# Altium schematic sheet Schematic Tugas 1_Magang 2.SchDoc
size A4; SheetNumber: 1; SheetTotal: 1
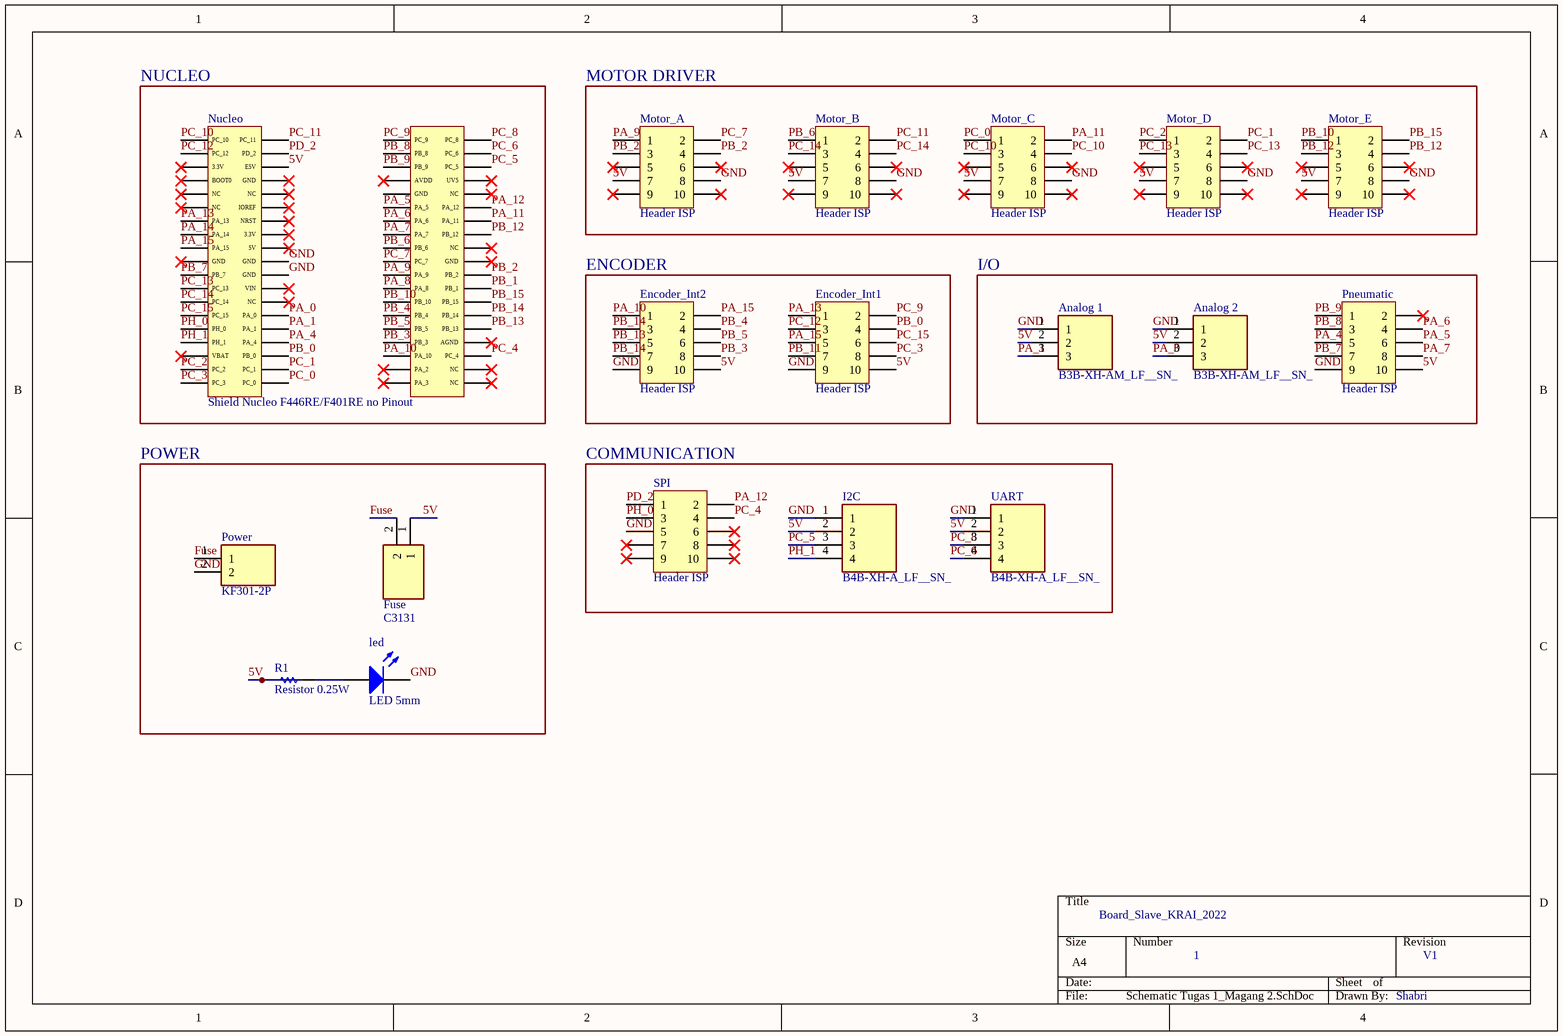
[diagram p0: Schematic Tugas 1_Magang 2.SchDoc]

## Parts
Analog_1  B3B-XH-AM_LF__SN_  [B3BXHAMLFSN]
Analog_2  B3B-XH-AM_LF__SN_  [B3BXHAMLFSN]
Encoder_Int1  Header ISP  [Header ISP]
Encoder_Int2  Header ISP  [Header ISP]
Fuse  C3131  [C3131]
I2C  B4B-XH-A_LF__SN_  [B4BXHALFSN]
led  LED 5mm  [LED 5mm]
Motor_A  Header ISP  [Header ISP]
Motor_B  Header ISP  [Header ISP]
Motor_C  Header ISP  [Header ISP]
Motor_D  Header ISP  [Header ISP]
Motor_E  Header ISP  [Header ISP]
Nucleo  Shield Nucleo F446RE/F401RE no Pinout  [Shield Nucleo-F446RE/F401RE-tanpaPinOut]
Pneumatic  Header ISP  [Header ISP]
Power  KF301-2P  [KF3012P]
R1  Resistor 0.25W  [Resistor 0.25W]
SPI  Header ISP  [Header ISP]
UART  B4B-XH-A_LF__SN_  [B4BXHALFSN]

## Blocks framed on the sheet
NUCLEO: Nucleo
MOTOR DRIVER: Motor_A Motor_B Motor_C Motor_D Motor_E
ENCODER: Encoder_Int1 Encoder_Int2
I/O: Analog_1 Analog_2 Pneumatic
POWER: Fuse led Power R1
COMMUNICATION: I2C SPI UART

## Nets
5V: Analog_1.2 Analog_2.2 Encoder_Int1.10 Encoder_Int2.10 Fuse.1 I2C.2 Motor_A.7 Motor_B.7 Motor_C.7 Motor_D.7 Motor_E.7 Nucleo.E5V Pneumatic.10 R1.1 UART.2
Fuse: Fuse.2 Power.1
GND: Analog_1.1 Analog_2.1 Encoder_Int1.9 Encoder_Int2.9 I2C.1 led.2(K) Motor_A.8 Motor_B.8 Motor_C.8 Motor_D.8 Motor_E.8 Nucleo.GND2(GND) Nucleo.GND3(GND) Pneumatic.9 Power.2 SPI.5 UART.1
PA_0: Analog_2.3 Nucleo.PA_0
PA_1: Analog_1.3 Nucleo.PA_1
PA_4: Nucleo.PA_4 Pneumatic.5
PA_5: Nucleo.PA_5 Pneumatic.6
PA_6: Nucleo.PA_6 Pneumatic.4
PA_7: Nucleo.PA_7 Pneumatic.8
PA_8: Nucleo.PA_8
PA_9: Motor_A.1 Nucleo.PA_9
PA_10: Encoder_Int2.1 Nucleo.PA_10
PA_11: Motor_C.2 Nucleo.PA_11
PA_12: Nucleo.PA_12 SPI.2
PA_13: Encoder_Int1.1 Nucleo.PA_13
PA_14: Nucleo.PA_14
PA_15: Encoder_Int1.5 Encoder_Int2.2 Nucleo.PA_15
PB_0: Encoder_Int1.4 Nucleo.PB_0
PB_1: Nucleo.PB_1
PB_2: Motor_A.3 Motor_A.4 Nucleo.PB_2
PB_3: Encoder_Int2.8 Nucleo.PB_3
PB_4: Encoder_Int2.4 Nucleo.PB_4
PB_5: Encoder_Int2.6 Nucleo.PB_5
PB_6: Motor_B.1 Nucleo.PB_6
PB_7: Nucleo.PB_7 Pneumatic.7
PB_8: Nucleo.PB_8 Pneumatic.3
PB_9: Nucleo.PB_9 Pneumatic.1
PB_10: Motor_E.1 Nucleo.PB_10
PB_11: Encoder_Int1.7
PB_12: Motor_E.3 Motor_E.4 Nucleo.PB_12
PB_13: Encoder_Int2.5 Nucleo.PB_13
PB_14: Encoder_Int2.3 Encoder_Int2.7 Nucleo.PB_14
PB_15: Motor_E.2 Nucleo.PB_15
PC_0: Motor_C.1 Nucleo.PC_0
PC_1: Motor_D.2 Nucleo.PC_1
PC_2: Motor_D.1 Nucleo.PC_2
PC_3: Encoder_Int1.8 Nucleo.PC_3
PC_4: Nucleo.PC_4 SPI.4
PC_5: I2C.3 Nucleo.PC_5
PC_6: Nucleo.PC_6 UART.4
PC_7: Motor_A.2 Nucleo.PC_7
PC_8: Nucleo.PC_8 UART.3
PC_9: Encoder_Int1.2 Nucleo.PC_9
PC_10: Motor_C.3 Motor_C.4 Nucleo.PC_10
PC_11: Motor_B.2 Nucleo.PC_11
PC_12: Encoder_Int1.3 Nucleo.PC_12
PC_13: Motor_D.3 Motor_D.4 Nucleo.PC_13
PC_14: Motor_B.3 Motor_B.4 Nucleo.PC_14
PC_15: Encoder_Int1.6 Nucleo.PC_15
PD_2: Nucleo.PD_2 SPI.1
PH_0: Nucleo.PH_0 SPI.3
PH_1: I2C.4 Nucleo.PH_1
Netled_1: led.1(A) R1.2

Not connected (* = marked no-connect by the designer): Motor_A 5* 6* 9* 10*; Motor_B 5* 6* 9* 10*; Motor_C 5* 6* 9* 10*; Motor_D 5* 6* 9* 10*; Motor_E 5* 6* 9* 10*; Nucleo 3.3V* 3V3(3.3V)* 5V* AGND* AVDD* BOOT0* GND* GND1(GND)* GND4(GND) GND5(GND)* IOREF* NC1(NC)* NC2(NC)* NC3(NC)* NC4(NC)* NC5(NC)* NC6(NC)* NC7(NC)* NC8(NC)* NRST* PA_2* PA_3* UV5* VBAT* VIN*; Pneumatic 2*; SPI 6* 7* 8* 9* 10*

## Notes on the sheet
- Board_Slave_KRAI_2022
- 1
- V1
- Shabri

## Library data of the parts
Analog_1 Analog_2 = B3B-XH-AM_LF__SN_: Connector; Manufacturer_Name: JST (JAPAN SOLDERLESS TERMINALS); Manufacturer_Part_Number: B3B-XH-AM(LF)(SN); Datasheet Link: http://www.jst-mfg.com/product/pdf/eng/eXH.pdf; Height: 7mm; Arrow Part Number: B3B-XH-AM(LF)(SN); Arrow Price/Stock: https://www.arrow.com/en/products/b3b-xh-a-m-lf-sn/jst-manufacturing?region=europe
Fuse = C3131: Undefined or Miscellaneous; Manufacturer_Name: Xucheng Elec; Datasheet Link: https://datasheet.lcsc.com/szlcsc/XC-Elec-Shenzhen-5x20-BLX-Fuse-holder_C3131.pdf; Height: 10.5mm; Manufacturer_Part_Number: C3131
I2C UART = B4B-XH-A_LF__SN_: Connector; Manufacturer_Name: JST (JAPAN SOLDERLESS TERMINALS); Manufacturer_Part_Number: B4B-XH-A(LF)(SN); Datasheet Link: https://datasheet.lcsc.com/szlcsc/JST-Sales-America-B4B-XH-A-LF-SN_C144395.pdf; Height: 7mm; Arrow Part Number: B4B-XH-A(LF)(SN); Arrow Price/Stock: https://www.arrow.com/en/products/b4b-xh-a-lf-sn/jst-manufacturing
Nucleo = Shield Nucleo-F446RE/F401RE-tanpa Pinout: Tanpa Pinout
Power = KF301-2P: Connector; Manufacturer_Name: Handson Technology; Datasheet Link: http://www.handsontec.com/dataspecs/terminal%20block-5mm.pdf; Height: 10mm; Manufacturer_Part_Number: KF301-2P